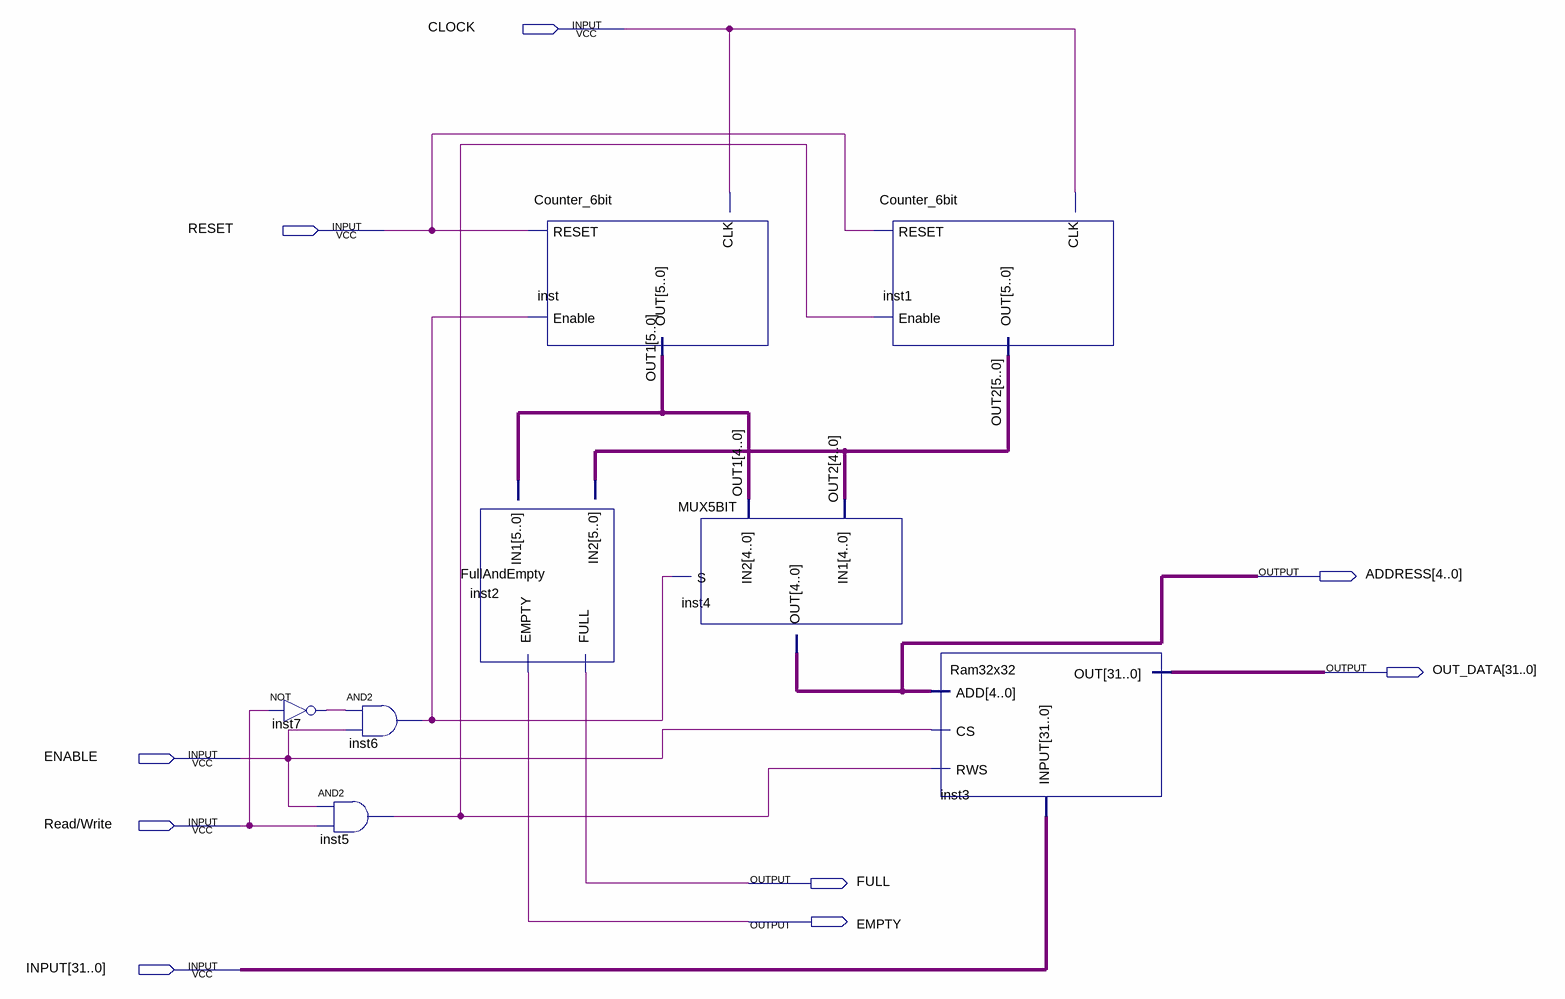
[diagram p0: schematic sheet]
// Quartus schematic Queue.bdf as structural Verilog: 8 symbols, 9 pins
module Queue (
  input  CLOCK,
  input  RESET,
  input  ENABLE,
  input  \Read/Write ,
  input  [31:0] INPUT,
  output [4:0] ADDRESS,
  output [31:0] OUT_DATA,
  output FULL,
  output EMPTY
);

  wire inst5_out, inst6_out, inst7_out;
  wire [5:0] OUT1, OUT2;

  not inst7 (inst7_out, \Read/Write );
  and inst5 (inst5_out, ENABLE, \Read/Write );
  and inst6 (inst6_out, inst7_out, ENABLE);
  FullAndEmpty inst2 (.IN1(OUT1), .IN2(OUT2), .FULL(FULL), .EMPTY(EMPTY));
  Counter_6bit inst (.RESET(RESET), .Enable(inst6_out), .CLK(CLOCK), .OUT(OUT1));
  MUX5BIT inst4 (.IN1(OUT2[4:0]), .IN2(OUT1[4:0]), .S(inst6_out), .OUT(ADDRESS));
  Counter_6bit inst1 (.RESET(RESET), .Enable(inst5_out), .CLK(CLOCK), .OUT(OUT2));
  Ram32x32 inst3 (.INPUT(INPUT), .ADD(ADDRESS), .RWS(inst5_out), .CS(ENABLE), .OUT(OUT_DATA));
endmodule
